# Altium schematic sheet Atmega328PB.SchDoc
size 420 x 297 mm; Author: Denizhan ALTAY; SheetNumber: 4; SheetTotal: 4
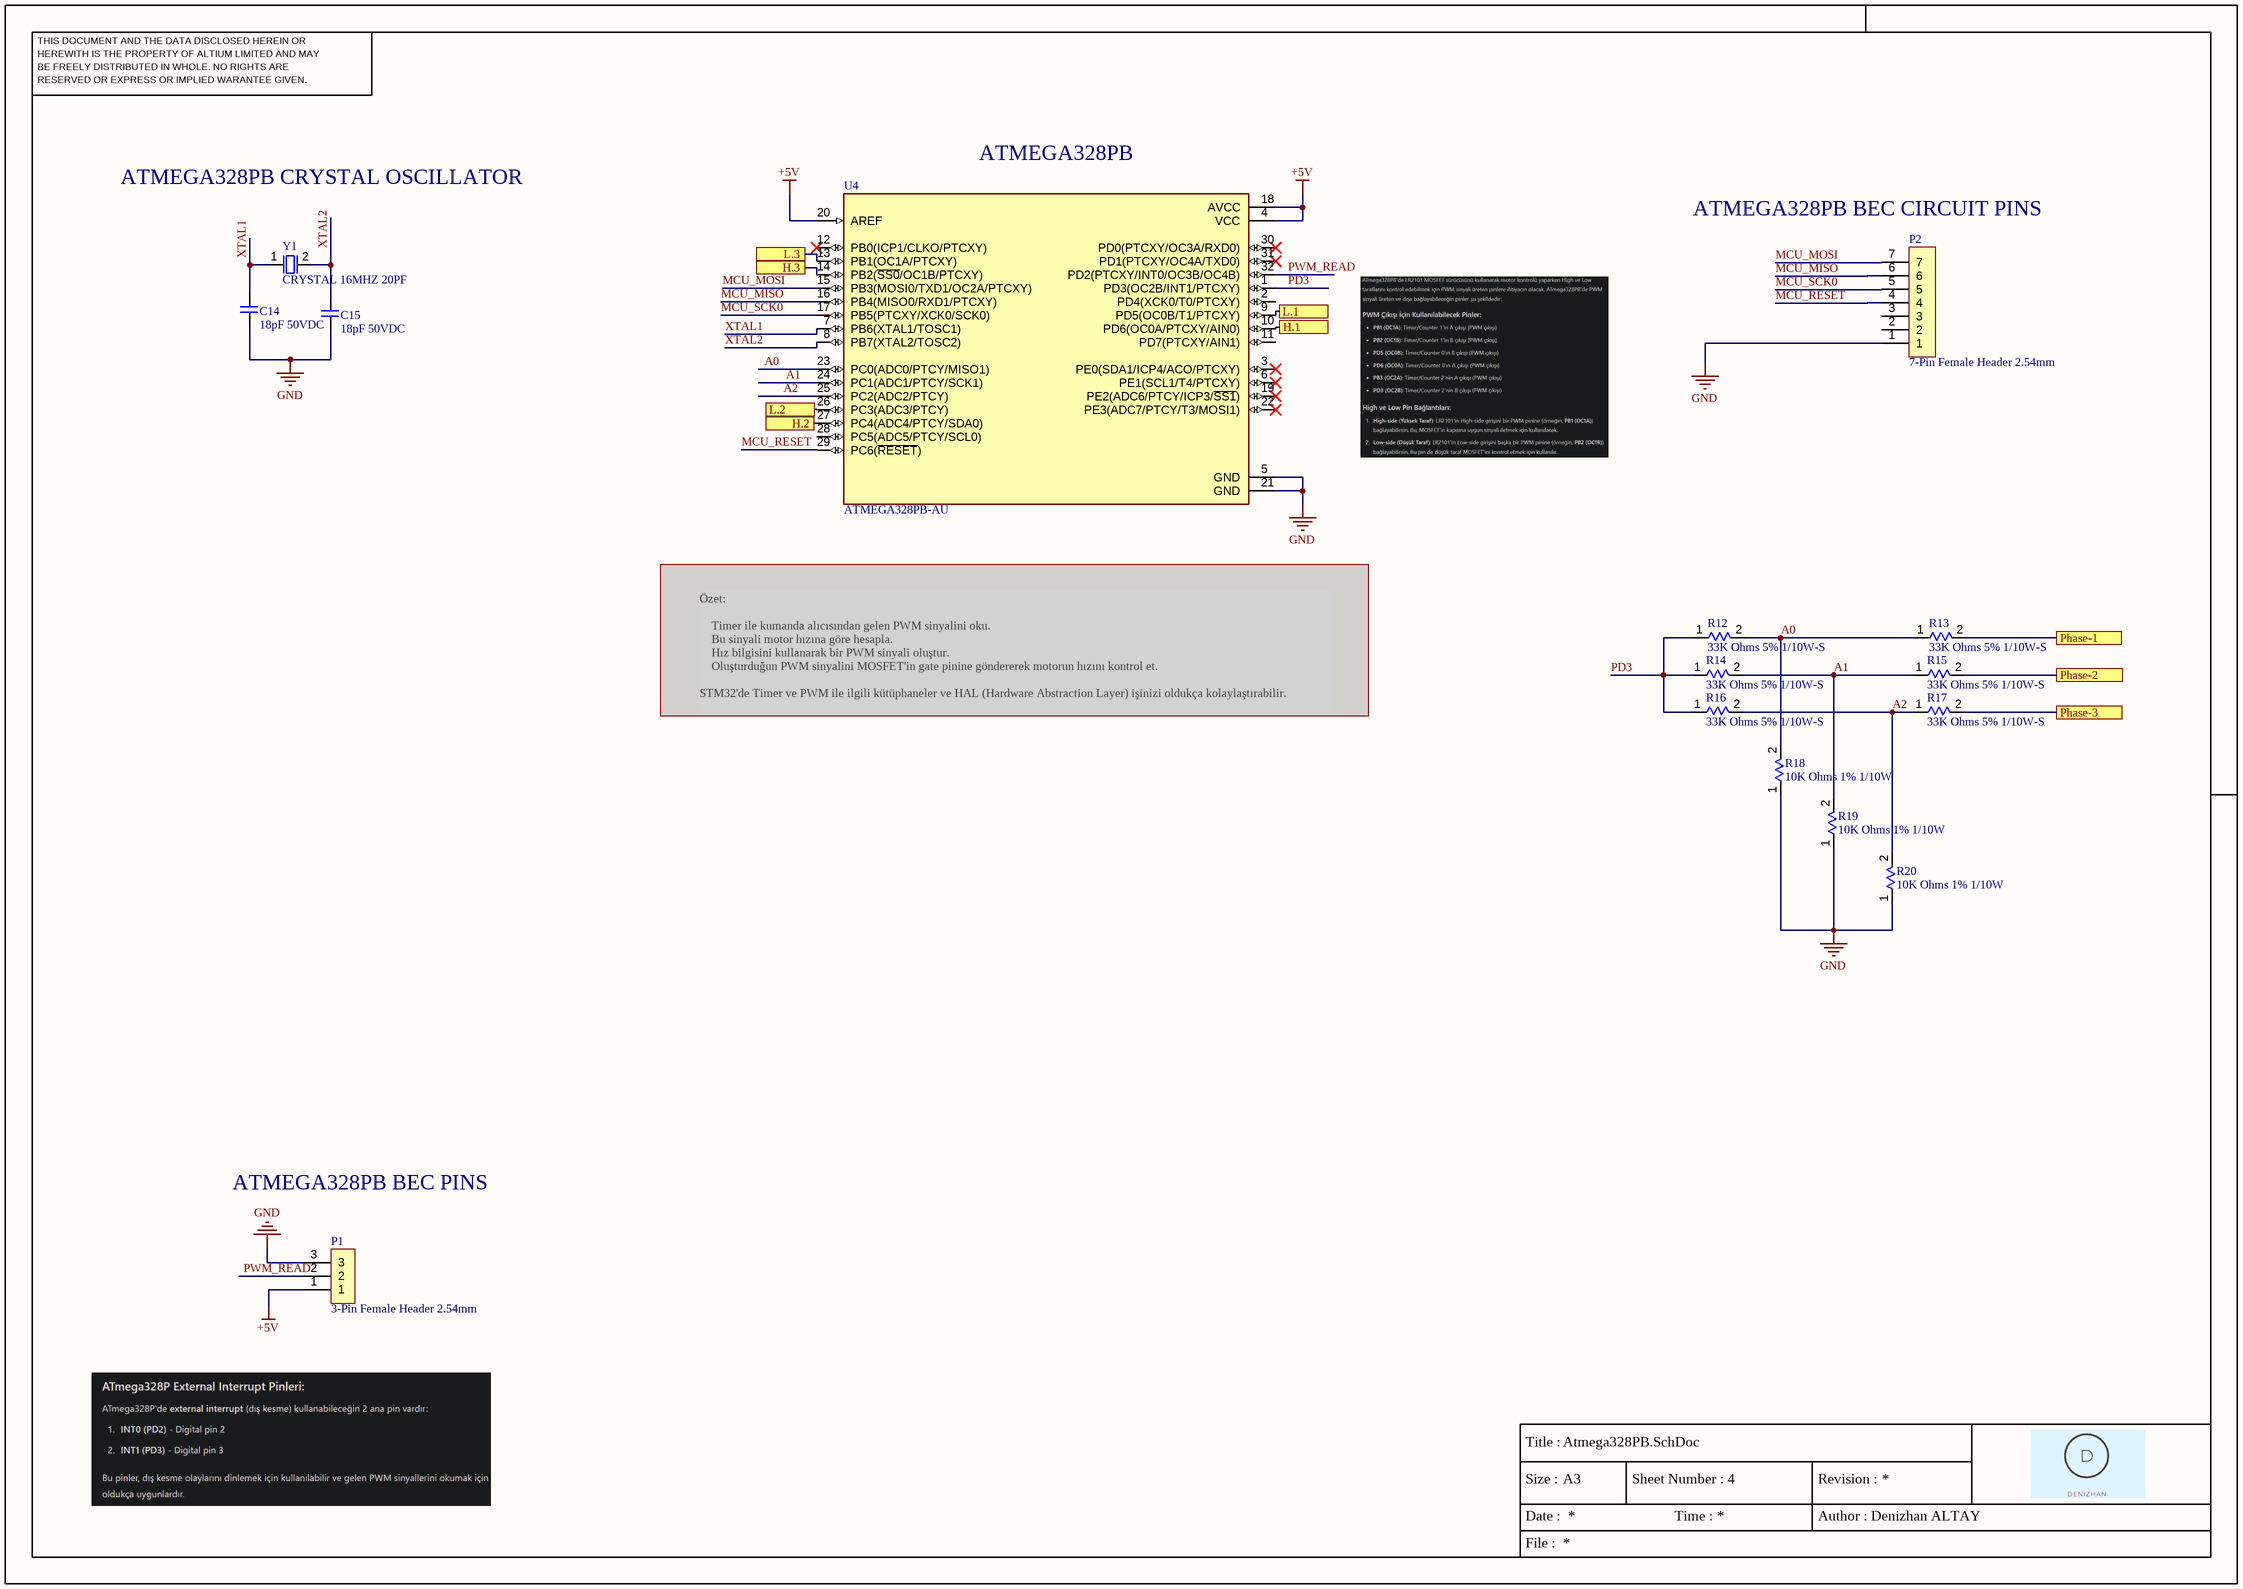
[diagram p0: Atmega328PB.SchDoc]

## Parts
C14  18pF 50VDC  [0603_UNP_Cap]
C15  18pF 50VDC  [0603_UNP_Cap]
P1  3-Pin Female Header 2.54mm  [1x3 Pin Female Header 2.54mm]
P2  7-Pin Female Header 2.54mm  [Single 7-Pin (2.54mm) Female Header]
R12  33K Ohms 5% 1/10W-S  [0603_Resistor_Case]
R13  33K Ohms 5% 1/10W-S  [0603_Resistor_Case]
R14  33K Ohms 5% 1/10W-S  [0603_Resistor_Case]
R15  33K Ohms 5% 1/10W-S  [0603_Resistor_Case]
R16  33K Ohms 5% 1/10W-S  [0603_Resistor_Case]
R17  33K Ohms 5% 1/10W-S  [0603_Resistor_Case]
R18  10K Ohms 1% 1/10W  [0603_Resistor_Case]
R19  10K Ohms 1% 1/10W  [0603_Resistor_Case]
R20  10K Ohms 1% 1/10W  [0603_Resistor_Case]
U4  ATMEGA328PB-AU  [ATMEGA328PB-AU]
Y1  CRYSTAL 16MHZ 20PF  [16MHZ_CrsytalOscillator]

## Ports
H.1 (see MosfetDrivers[1B]), H.2 (see MosfetDrivers[1C]), H.3 (see MosfetDrivers[4B]), L.1 (see MosfetDrivers[1B]), L.2 (see MosfetDrivers[1C]), L.3 (see MosfetDrivers[4B]), Phase-1 (see MosfetDrivers[2B], MosfetDrivers[4C]), Phase-2 (see MosfetDrivers[2C], MosfetDrivers[5C]), Phase-3 (see MosfetDrivers[5C], MosfetDrivers[6B])

## Nets
+5V: P1.1 U4.4(VCC) U4.18(AVCC) U4.20(AREF)
GND: C14.1 C15.1 P1.3 P2.1 R18.1 R19.1 R20.1 U4.5(GND) U4.21(GND)
A0: R12.2 R13.1 R18.2 U4.23(PC0(ADC0/PTCY/MISO1))
A1: R14.2 R15.1 R19.2 U4.24(PC1(ADC1/PTCY/SCK1))
A2: R16.2 R17.1 R20.2 U4.25(PC2(ADC2/PTCY))
H.1: U4.10(PD6(OC0A/PTCXY/AIN0)) ; port H.1
H.2: U4.27(PC4(ADC4/PTCY/SDA0)) ; port H.2
H.3: U4.14(PB2(~{SS0}/OC1B/PTCXY)) ; port H.3
L.1: U4.9(PD5(OC0B/T1/PTCXY)) ; port L.1
L.2: U4.26(PC3(ADC3/PTCY)) ; port L.2
L.3: U4.13(PB1(OC1A/PTCXY)) ; port L.3
MCU_MISO: P2.6 U4.16(PB4(MISO0/RXD1/PTCXY))
MCU_MOSI: P2.7 U4.15(PB3(MOSI0/TXD1/OC2A/PTCXY))
MCU_RESET: P2.4 U4.29(PC6(~{RESET}))
MCU_SCK0: P2.5 U4.17(PB5(PTCXY/XCK0/SCK0))
PD3: R12.1 R14.1 R16.1 U4.1(PD3(OC2B/INT1/PTCXY))
Phase-1: R13.2 ; port Phase-1
Phase-2: R15.2 ; port Phase-2
Phase-3: R17.2 ; port Phase-3
PWM_READ: P1.2 U4.32(PD2(PTCXY/INT0/OC3B/OC4B))
XTAL1: C14.2 U4.7(PB6(XTAL1/TOSC1)) Y1.1
XTAL2: C15.2 U4.8(PB7(XTAL2/TOSC2)) Y1.2

Not connected (* = marked no-connect by the designer): P2 2 3; U4 2(PD4(XCK0/T0/PTCXY)) 3(PE0(SDA1/ICP4/ACO/PTCXY))* 6(PE1(SCL1/T4/PTCXY))* 11(PD7(PTCXY/AIN1)) 12(PB0(ICP1/CLKO/PTCXY))* 19(PE2(ADC6/PTCY/ICP3/~{SS1}))* 22(PE3(ADC7/PTCY/T3/MOSI1))* 28(PC5(ADC5/PTCY/SCL0)) 30(PD0(PTCXY/OC3A/RXD0))* 31(PD1(PTCXY/OC4A/TXD0))*

## Notes on the sheet
- ATMEGA328PB CRYSTAL OSCILLATOR
- (near U4) ATMEGA328PB
- (near P2) ATMEGA328PB BEC CIRCUIT PINS
- Özet:
  Timer ile kumanda alıcısından gelen PWM sinyalini oku.
  Bu sinyali motor hızına göre hesapla.
  Hız bilgisini kullanarak bir PWM sinyali oluştur.
  Oluşturduğun PWM sinyalini MOSFET'in gate pinine göndererek motorun hızını kontrol et.
  STM32'de Timer ve PWM ile ilgili kütüphaneler ve HAL (Hardware Abstraction Layer) işinizi oldukça kolaylaştırabilir.
- ATMEGA328PB BEC PINS
- THIS DOCUMENT AND THE DATA DISCLOSED HEREIN OR
- HEREWITH IS THE PROPERTY OF ALTIUM LIMITED AND MAY
- BE FREELY DISTRIBUTED IN WHOLE. NO RIGHTS ARE
- RESERVED OR EXPRESS OR IMPLIED WARANTEE GIVEN.
- Title :
- Size :
- Date :
- A3
- Sheet Number :
- Time :
- Revision :
- Author :
- File :

## Library data of the parts
C14 C15 = MCF03JTN500180 - MLCC 0603 18pF 50VDC ±5% C0G (NP0): MCF03JTN500180 - MLCC (1608) 0603 18pF 50VDC ±5% C0G (NP0); Manufacturer: VIKING; Part Number: MCF03MTX250106; Capacitor Type: Ceramic; Library Ref: Capacitors; Package / Case: 0603; Capacitor Value: 18pF; ComponentLink1Description: New link; ComponentLink1URL: https://www.ozdisan.com/passive-components/resistors/smt-smd-and-chip-resistors/PS03W4F1003T5E/592727; Max Working Voltage: 50VDC
P1 = Single 3-Pin (2.54mm) Female Header: Library Ref: Header
P2 = Single 7-Pin (2.54mm) Female Header: Library Ref: Header
R12-R17 = 0603SAJ0333T5E - RES. 0603 33K Ohms 5% 1/10W-S 100PPM: 0603SAJ0333T5E - RES.(1608) 0603 33K Ohms 5% 1/10W-S 100PPM; Manufacturer: ROYALOHM; Power (Watts): 1/10W; Working Voltage (Max): 75V; Library Ref: Resistors; Package / Case: 0603; Resistor Value: 33K Ohms; Part Number: 0603SAJ0333T5E; ComponentLink1Description: New link; ComponentLink1URL: https://www.ozdisan.com/passive-components/resistors/smt-smd-and-chip-resistors/PS03W4F1003T5E/592727
R18-R20 = RC0603FR-0710KL - 0603 10K Ohms 1% 1/10W 100PPM: Manufacturer: HOTTECH; Part Number: PS03W4F1003T5E; Max Working Voltage: 75V; Library Ref: Resistors; Package / Case: 0603; Power (Watts): 1/10W; Resistor Value: 10K Ohms; ComponentLink1Description: New link; ComponentLink1URL: https://www.ozdisan.com/passive-components/resistors/smt-smd-and-chip-resistors/PS03W4F1003T5E/592727
U4 = ATMEGA328PB-AU: ATmega Series 20 MHz 32 KB Flash 2 KB SRAM 8-Bit Microcontroller - TQFP-32; MF: {'manufacturer': u'Microchip Technology'}; Price: None; Availability: Unavailable; Package / Case: SMD; Library Ref: Microprocessors; Name: ATMEGA328PB-AU
Y1 = AS-16.000-20-SMD-TR - CRYSTAL 16.0000MHZ 20PF SMD: Button Size: 12mm; Library Ref: Oscillator; Package / Case: SMD; Oscillator Type: Crystal; Part Number: AS-16.000-20-SMD-TR